# EAGLE design ME433_proto_board_Athulya (EAGLE 5.12)
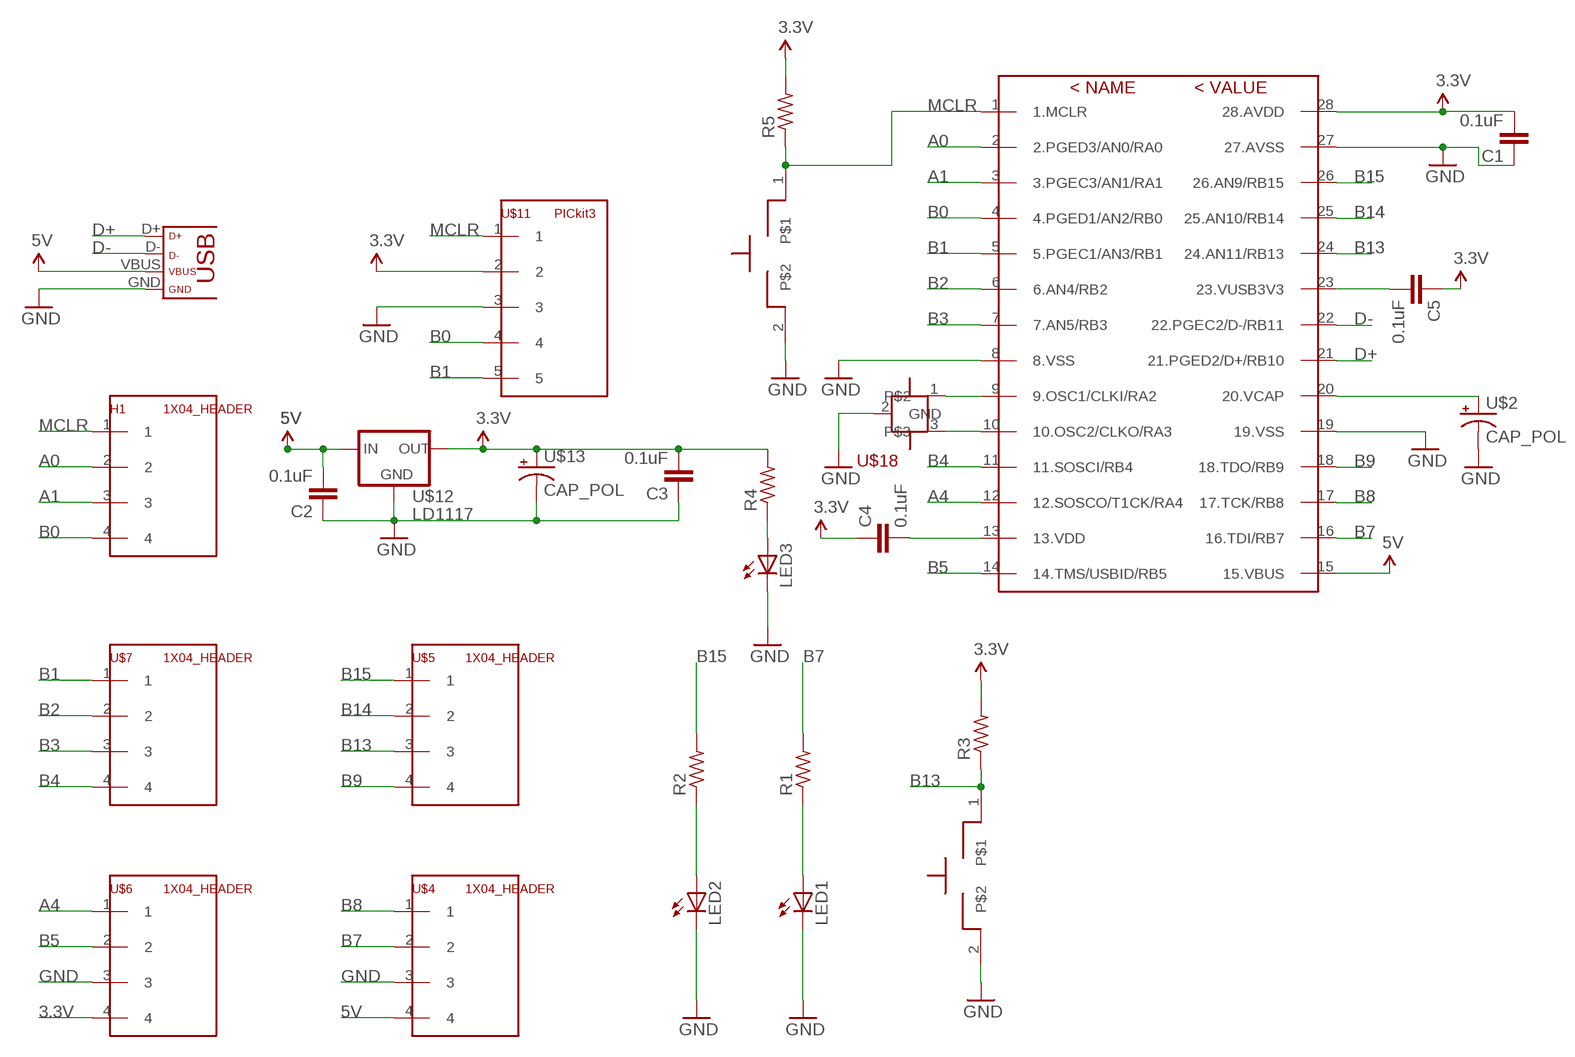
[diagram p0: schematic, sheet 1]

## Parts
C1  0.1uF  C-EU025-025X050  [C025-025X050]
C2  0.1uF  C-EU025-025X050  [C025-025X050]
C3  0.1uF  C-EU025-025X050  [C025-025X050]
C4  0.1uF  C-EU025-025X050  [C025-025X050]
C5  0.1uF  C-EU025-025X050  [C025-025X050]
H1  1X04_HEADER  [1X04]
LED1  LED3MM  [LED3MM]
LED2  LED3MM  [LED3MM]
LED3  LED3MM  [LED3MM]
R1  R-US_0204/7  [0204/7]
R2  R-US_0204/7  [0204/7]
R3  R-US_0204/7  [0204/7]
R4  R-US_0204/7  [0204/7]
R5  R-US_0204/7  [0204/7]
U$1  PIC32  [DIL28-3]
U$2  CAP_POL  [CAP_POL_D]
U$4  1X04_HEADER  [1X04]
U$5  1X04_HEADER  [1X04]
U$6  1X04_HEADER  [1X04]
U$7  1X04_HEADER  [1X04]
U$9  USB  [USB-MINIB]
U$11  PICkit3  1X05_HEADER  [1X05]
U$12  LD1117  [TO220]
U$13  CAP_POL  [CAP_POL_D]
U$16  BUTTON  BUTTOIN  [0204/5]
U$17  BUTTON  BUTTOIN  [0204/5]
U$18  CRYSTAL  [1X03]

## Nets
3.3V: C1.2 C3.2 C4.1 C5.1 R3.2 R4.2 R5.2 U$1.28(28.AVDD) U$6.4 U$11.2 U$12.2(OUT) U$13.1(+)
5V: C2.2 U$1.15(15.VBUS) U$4.4 U$9.VBUS U$12.3(IN)
A0: H1.2 U$1.2(2.PGED3/AN0/RA0)
A1: H1.3 U$1.3(3.PGEC3/AN1/RA1)
A4: U$1.12(12.SOSCO/T1CK/RA4) U$6.1
B0: H1.4 U$1.4(4.PGED1/AN2/RB0) U$11.4
B1: U$1.5(5.PGEC1/AN3/RB1) U$7.1 U$11.5
B2: U$1.6(6.AN4/RB2) U$7.2
B3: U$1.7(7.AN5/RB3) U$7.3
B4: U$1.11(11.SOSCI/RB4) U$7.4
B5: U$1.14(14.TMS/USBID/RB5) U$6.2
B7: R1.2 U$1.16(16.TDI/RB7) U$4.2
B8: U$1.17(17.TCK/RB8) U$4.1
B9: U$1.18(18.TDO/RB9) U$5.4
B13: R3.1 U$1.24(24.AN11/RB13) U$5.3 U$17.1
B14: U$1.25(25.AN10/RB14) U$5.2
B15: R2.2 U$1.26(26.AN9/RB15) U$5.1
D+: U$1.21(21.PGED2/D+/RB10) U$9.D+
D-: U$1.22(22.PGEC2/D-/RB11) U$9.D-
GND: C1.1 C2.1 C3.1 LED1.K(C) LED2.K(C) LED3.K(C) U$1.8(8.VSS) U$1.19(19.VSS) U$1.27(27.AVSS) U$2.2(-) U$4.3 U$6.3 U$9.GND U$11.3 U$12.1(GND) U$13.2(-) U$16.2 U$17.2 U$18.2(GND)
MCLR: H1.1 R5.1 U$1.1(1.MCLR) U$11.1 U$16.1
N$1: U$1.9(9.OSC1/CLKI/RA2) U$18.1
N$2: U$1.20(20.VCAP) U$2.1(+)
N$3: LED1.A R1.1
N$4: LED2.A R2.1
N$5: LED3.A R4.1
N$6: U$1.10(10.OSC2/CLKO/RA3) U$18.3
N$8: C4.2 U$1.13(13.VDD)
N$9: C5.2 U$1.23(23.VUSB3V3)

## Library data of the parts
C1-C5 = ME433:C-EU: CAPACITOR, European symbol
H1 U$4-U$7 = ME433:1X04_HEADER
LED1-LED3 = ME433:LED: LED OSRAM: - CHIPLED LG R971, LG N971, LY N971, LG Q971, LY Q971, LO R971, LY R971 LH N974, LH R974 LS Q976, LO Q976, LY Q976 LO Q996 - Hyper CHIPLED LW Q18S LB Q993, LB Q99A, LB R99A - SideLED LS A670, LO A670, LY A670, LG A670, LP A670 LB A673, LV A673, LT A673, LW A673 LH A674 LY A675 LS A676, LA A676, LO A676, LY A676, LW A676 LS A679, LY A679, LG A679 - Hyper Micro SIDELED® LS Y876, LA Y876, LO Y876, LY Y876 LT Y87S - SmartLED LW L88C, LW L88S LB L89C, LB L89S, LG L890 LS L89K, LO L89K, LY L89K LS L896, LA L896, LO L896, LY L896 - TOPLED LS T670, LO T670, LY T670, LG T670, LP T670 LSG T670, LSP T670, LSY T670, LOP T670, LYG T670 LG T671, LOG T671, LSG T671 LB T673, LV T673, LT T673, LW T673 LH T674 LS T676, LA T676, LO T676, LY T676, LB T676, LH T676, LSB T676, LW T676 LB T67C, LV T67C, LT T67C, LS T67K, LO T67K, LY T67K, LW E67C LS E67B, LA E67B, LO E67B, LY E67B, LB E67C, LV E67C, LT E67C LW T67C LS T679, LY T679, LG T679 LS T770, LO T770, LY T770, LG T770, LP T770 LB T773, LV T773, LT T773, LW T773 LH T774 LS E675, LA E675, LY E675, LS T675 LS T776, LA T776, LO T776, LY T776, LB T776 LHGB T686 LT T68C, LB T68C - Hyper Mini TOPLED® LB M676 - Mini TOPLED Santana® LG M470 LS M47K, LO M47K, LY M47K Source: http://www.osram.convergy.de LUXEON: - LUMILED® LXK2-PW12-R00, LXK2-PW12-S00, LXK2-PW14-U00, LXK2-PW14-V00 LXK2-PM12-R00, LXK2-PM12-S00, LXK2-PM14-U00 LXK2-PE12-Q00, LXK2-PE12-R00, LXK2-PE12-S00, LXK2-PE14-T00, LXK2-PE14-U00 LXK2-PB12-K00, LXK2-PB12-L00, LXK2-PB12-M00, LXK2-PB14-N00, LXK2-PB14-P00, LXK2-PB14-Q00 LXK2-PR12-L00, LXK2-PR12-M00, LXK2-PR14-Q00, LXK2-PR14-R00 LXK2-PD12-Q00, LXK2-PD12-R00, LXK2-PD12-S00 LXK2-PH12-R00, LXK2-PH12-S00 LXK2-PL12-P00, LXK2-PL12-Q00, LXK2-PL12-R00 Source: www.luxeon.com KINGBRIGHT: KA-3528ASYC Source: www.kingbright.com
R1-R5 = ME433:R-US_: RESISTOR, American symbol
U$1 = ME433:PIC32
U$2 U$13 = ME433:CAP_POL
U$9 = ME433:USB
U$11 = ME433:1X05_HEADER
U$12 = ME433:LD1117
U$16 U$17 = ME433:BUTTOIN
U$18 = ME433:CRYSTAL

## Board
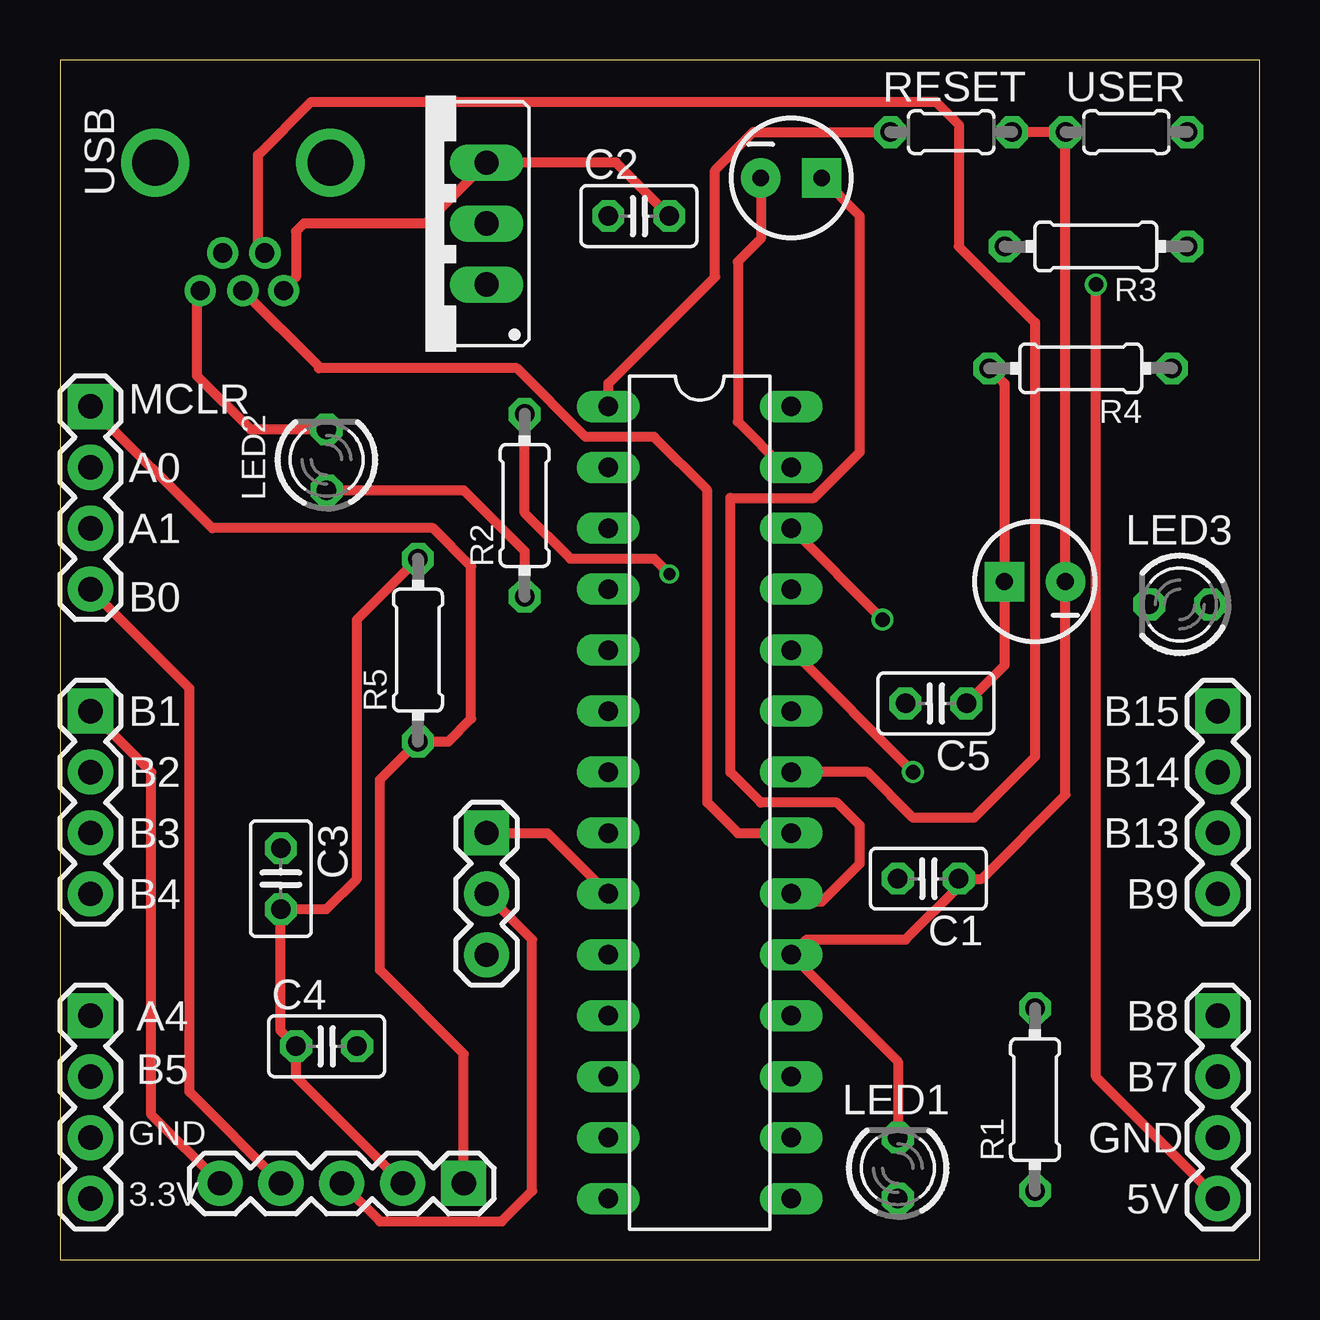
[diagram p1: board, top side]
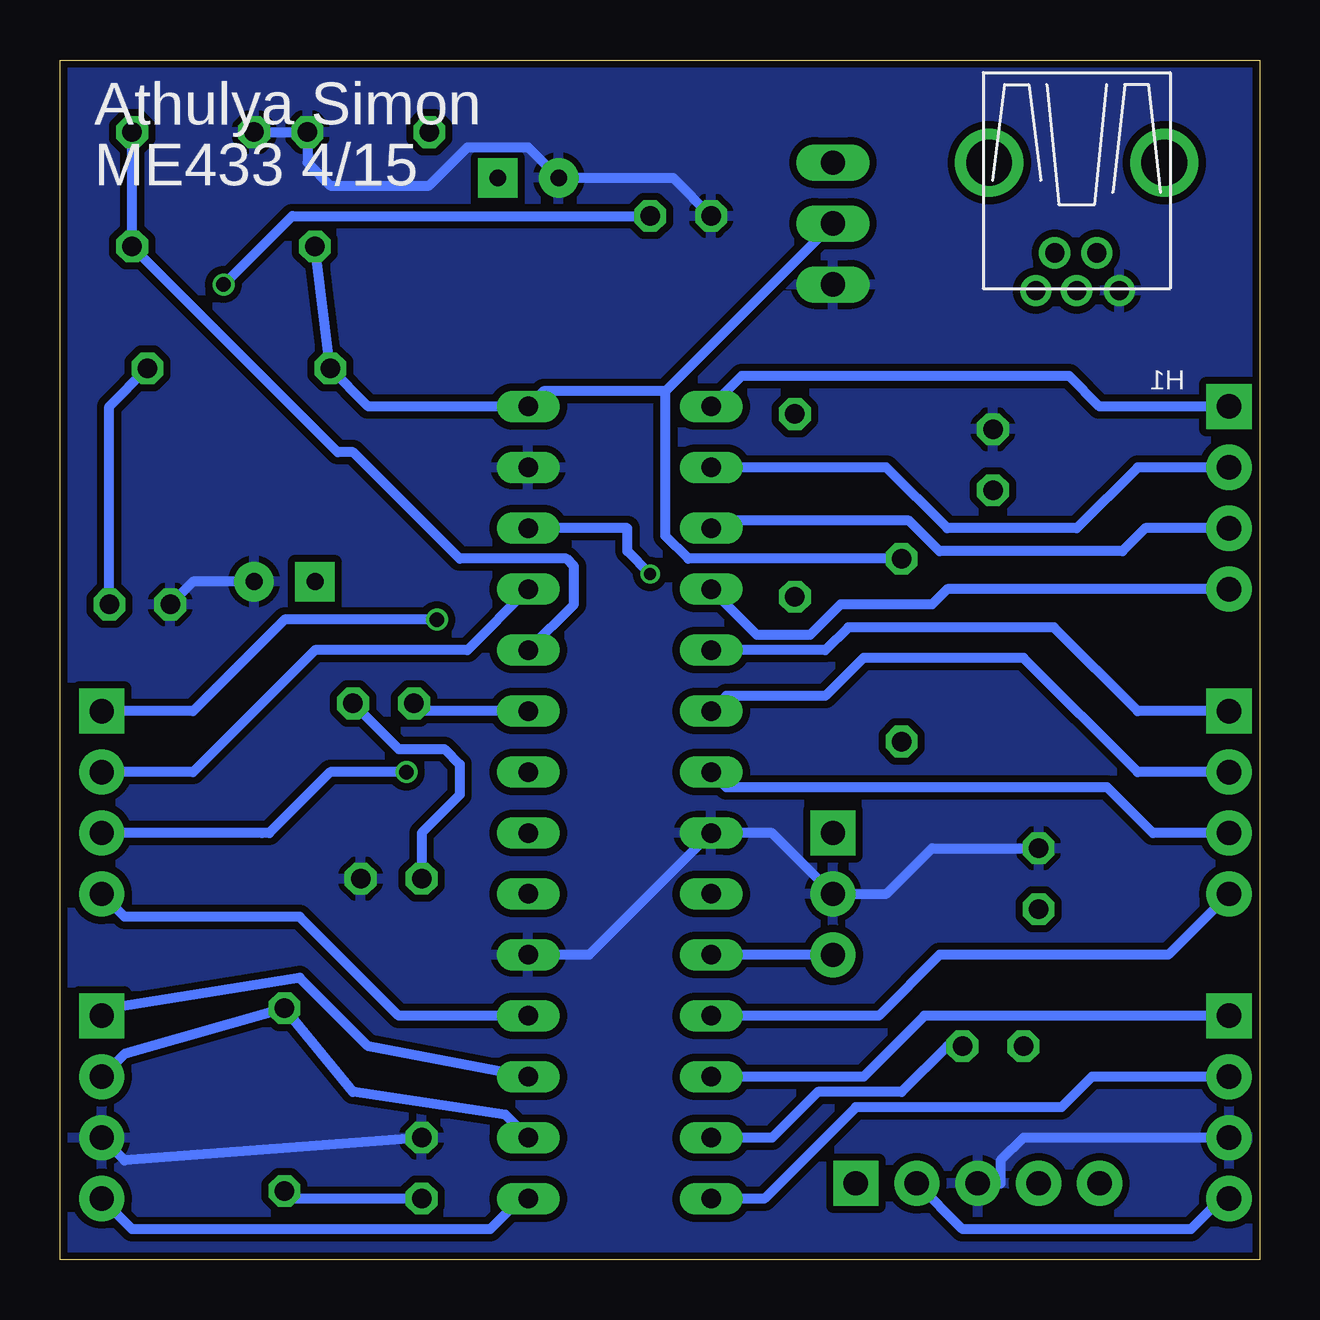
[diagram p2: board, bottom side, seen from below]

Size 50 x 50 mm. Coordinates in mm from the lower left corner, seen from the top.
Outline: 0,0 50,0 50,50 0,50 0,0
Copper layers (1*16): Top 0.035mm / dielectric 1.5mm / Bottom 0.035mm
Design rules "SeeedStudio_2layer_DRU_no_angle_20140221": minimum track width 6mil, minimum drill 12mil, track to track 6mil, track to pad 6mil, pad to pad 6mil, via to via 6mil, smd to smd 0mil, copper to edge 10mil, drill to drill 10mil, minimum pad ring 10mil, minimum via ring 6mil, stop-mask expansion 2mil, vias tented up to drill 100mil, thermal gap 10mil

### Footprints (pad centres in the part's own frame; a part is rotated, then mirrored left to right if it is on the bottom)
C025-025X050 = drill 0.813 octagon: 1 -1.27,0; 2 1.27,0
1X04 = drill 1.016 pad 1.88 square: 1 0,0 | drill 1.016 pad 1.88 round: 2 2.54,0; 3 5.08,0; 4 7.62,0
LED3MM = drill 0.813 octagon: A -1.27,0; K 1.27,0
0204/7 = drill 0.813 octagon: 1 -3.81,0; 2 3.81,0
DIL28-3 = drill 0.813 long: 1 -16.51,-3.81; 2 -13.97,-3.81; 3 -11.43,-3.81; 4 -8.89,-3.81; 5 -6.35,-3.81; 6 -3.81,-3.81; 7 -1.27,-3.81; 8 1.27,-3.81; 9 3.81,-3.81; 10 6.35,-3.81; 11 8.89,-3.81; 12 11.43,-3.81; 13 13.97,-3.81; 14 16.51,-3.81; 15 16.51,3.81; 16 13.97,3.81; 17 11.43,3.81; 18 8.89,3.81; 19 6.35,3.81; 20 3.81,3.81; 21 1.27,3.81; 22 -1.27,3.81; 23 -3.81,3.81; 24 -6.35,3.81; 25 -8.89,3.81; 26 -11.43,3.81; 27 -13.97,3.81; 28 -16.51,3.81
CAP_POL_D = drill 0.7 pad 1.651 square: 1 1.27,0 | drill 0.7 pad 1.651 round: 2 -1.27,0
USB-MINIB = drill 0.8 round: D+ 4.064,0; D- 2.489,0.914; GND 4.064,-1.778; ID 2.489,-0.838; VBUS 4.064,1.702 | drill 1.9 round: P$6 -1.27,-3.65; P$7 -1.27,3.65
1X05 = drill 1.016 pad 1.88 square: 1 0,0 | drill 1.016 pad 1.88 round: 2 2.54,0; 3 5.08,0; 4 7.62,0; 5 10.16,0
TO220 = drill 1.016 long: 1 -2.54,0; 2 0,0; 3 2.54,0
0204/5 = drill 0.813 octagon: 1 -2.54,0; 2 2.54,0
1X03 = drill 1.016 pad 1.88 square: 1 0,0 | drill 1.016 pad 1.88 round: 2 2.54,0; 3 5.08,0

### Placement (x,y rotation side)
C1  36.2,15.88 180 top
C2  24.13,43.5 0 top
C3  9.21,15.88 270 top
C4  11.11,8.89 0 top
C5  36.51,23.18 180 top
H1  1.27,35.56 270 top
LED1  34.92,3.81 90 top
LED2  11.11,33.34 90 top
LED3  46.67,27.3 180 top
R1  40.64,6.67 90 top
R2  19.37,31.43 90 top
R3  43.18,42.23 180 top
R4  42.55,37.15 180 top
R5  14.92,25.4 90 top
U$1  26.67,19.05 270 top
U$2  30.48,45.09 0 top
U$4  48.26,10.16 270 top
U$5  48.26,22.86 270 top
U$6  1.27,10.16 270 top
U$7  1.27,22.86 270 top
U$9  7.62,44.45 270 top
U$11  16.83,3.17 180 top
U$12  17.78,43.18 90 top
U$13  40.64,28.26 180 top
U$16  37.15,46.99 0 top
U$17  44.45,46.99 180 top
U$18  17.78,17.78 270 top

### Tracks (layer width: path | path; a pad name or v marks a point on that pad's centre or on a via)
3.3V
  Top 0.406: R4.2 39.37,36.51 U$13.1 39.37,24.77 C5.1 | U$11.2 9.84,7.62 C4.1 9.21,9.53 C3.2 11.11,14.61 12.38,15.88 12.38,26.67 R5.2
  Bottom 0.254: R3.2 39.37,41.91
  Bottom 0.406: R3.2 R4.2 37.15,35.56 U$1.28 29.84,36.2 24.77,36.2 | C5.1 35.88,21.27 33.97,21.27 33.34,20.64 33.34,19.37 34.92,17.78 C1.2 | U$6.4 1.59,2.54 2.86,1.27 12.38,1.27 U$11.2 | R5.2 23.81,29.21 24.77,30.16 24.77,36.2 | 24.77,36.2 U$12.2
5V  (via drill 0.61)
  Top 0.406: v43.18,40.64 43.18,7.62 U$4.4 | C2.2 23.18,45.72 U$12.3 15.24,43.18 10.16,43.18 9.84,42.86 9.84,40.96 9.32,40.44 U$9.VBUS
  Bottom 0.406: v43.18,40.64 40.32,43.5 C2.2 | U$1.15 30.8,2.54 32.07,1.27 46.99,1.27 U$4.4
A0
  Bottom 0.406: H1.2 5.08,33.02 7.62,30.48 13.02,30.48 15.56,33.02 U$1.2
A1
  Bottom 0.406: H1.3 4.76,30.48 5.71,29.53 13.34,29.53 14.61,30.8 22.54,30.8 U$1.3
A4
  Bottom 0.406: U$6.1 13.97,10.16 16.51,7.62 U$1.12
B0
  Top 0.406: U$11.4 5.4,6.99 5.4,23.81 H1.4
  Bottom 0.406: H1.4 13.02,27.94 13.65,27.3 17.46,27.3 18.73,26.04 20.95,26.04 U$1.4
B1
  Top 0.406: U$11.5 3.81,6.03 3.81,20.32 U$7.1
  Bottom 0.406: U$7.1 5.08,22.86 8.57,26.35 17.14,26.35 18.1,25.4 U$1.5
B2
  Bottom 0.406: U$7.2 5.08,20.32 9.84,25.08 16.51,25.08 18.1,23.5 22.23,23.5 U$1.6
B3
  Bottom 0.406: U$7.3 4.45,17.78 6.35,19.68 22.23,19.68 U$1.7
B4
  Bottom 0.406: U$1.11 15.88,10.16 13.34,12.7 3.81,12.7 U$7.4
B5
  Bottom 0.406: U$6.2 6.99,7.62 8.26,6.35 16.83,6.35 20.64,2.54 U$1.14
B7
  Bottom 0.406: U$4.2 47.31,8.57 R1.2 37.78,6.99 31.43,6.03 U$1.16
B8
  Bottom 0.406: U$1.17 37.15,8.89 40.01,11.75 47.94,10.48 U$4.1
B9
  Bottom 0.406: U$1.18 35.88,10.16 40.01,14.29 47.31,14.29 U$5.4
B13  (via drill 0.61)
  Top 0.406: U$1.24 v35.56,20.32
  Bottom 0.406: U$1.24 28.57,27.3 28.57,28.89 28.89,29.21 33.34,29.21 37.78,33.66 38.42,33.66 R3.1 U$17.1 | v35.56,20.32 38.73,20.32 41.27,17.78 41.59,17.78 | 41.59,17.78 U$5.3 | 41.59,17.78 48.58,17.78
B14
  Bottom 0.406: U$1.25 33.02,25.4 39.37,25.4 44.45,20.32 U$5.2
B15  (via drill 0.5, 0.61)
  Top 0.406: U$1.26 v34.29,26.67 | R2.2 19.37,31.11 21.27,29.21 24.77,29.21 v25.4,28.57
  Bottom 0.406: v34.29,26.67 40.64,26.67 44.45,22.86 U$5.1 | U$1.26 26.35,30.48 26.35,29.53 v25.4,28.57
D+
  Top 0.406: U$1.21 28.26,17.78 26.99,19.05 26.99,32.07 24.77,34.29 21.91,34.29 19.05,37.15 10.79,37.15 10.79,37.21 U$9.D+
D-
  Top 0.406: U$1.22 33.66,20.32 35.56,18.41 38.1,18.41 40.64,20.95 40.64,39.05 37.47,42.23 37.47,47.31 36.51,48.26 10.48,48.26 8.26,46.04 8.26,42.24 U$9.D-
GND
  Top 0.406: U$16.2 U$17.2 U$13.2 41.91,19.37 38.42,15.88 C1.1 37.47,15.56 35.24,13.34 31.11,13.34 U$1.19 34.92,8.26 LED1.K | U$18.2 19.68,13.34 19.68,2.86 18.41,1.59 13.34,1.59 U$11.3 | LED2.K 7.94,34.61 5.71,36.83 5.71,40.26 U$9.GND | U$1.27 30.16,33.02 28.26,34.92 28.26,41.59 29.21,42.55 U$2.2
  Bottom 0.406: U$17.2 U$16.2 39.69,45.72 38.73,44.77 34.61,44.77 33.02,46.35 30.48,46.35 U$2.2 24.45,45.09 C2.1 | U$13.2 44.45,28.26 LED3.K | LED1.K 47.31,4.13 U$4.3 | U$1.19 27.94,12.7 U$1.8 20.32,17.78 U$18.2 15.56,15.24 13.65,17.14 C3.1 | U$6.3 9.84,5.08 10.79,4.13 10.79,3.17 U$11.3
  pour Bottom (isolate 0.305): 0.32,49.53 0.32,0 50.16,0 50.16,49.85 0.32,49.85
MCLR
  Top 0.406: 0.95,35.88 H1.1 6.35,30.48 15.56,30.48 17.14,28.89 17.14,22.54 16.19,21.59 R5.1 13.34,20 13.34,12.06 16.83,8.57 U$11.1 | U$1.1 22.86,36.51 27.3,40.96 27.3,45.4 28.89,46.99 U$16.1
  Bottom 0.406: H1.1 6.67,35.56 7.94,36.83 21.59,36.83 U$1.1
N$1
  Top 0.406: U$18.1 20.32,17.78 U$1.9
N$2
  Top 0.406: U$2.1 33.34,43.5 33.34,33.66 31.43,31.75 27.94,31.75 27.94,20.32 29.21,19.05 32.38,19.05 33.34,18.1 33.34,16.51 31.75,14.92 30.8,14.92 U$1.20
N$3
  Bottom 0.406: LED1.A 40.32,2.54 R1.1
N$4
  Top 0.406: R2.1 19.37,29.53 16.83,32.07 LED2.A
N$5
  Bottom 0.406: LED3.A 47.94,35.56 R4.1
N$6
  Bottom 0.406: U$18.3 U$1.10
N$8
  Bottom 0.406: U$1.13 20.32,5.08 18.41,6.99 14.92,6.99 13.02,8.89 C4.2
N$9
  Bottom 0.406: U$1.23 34.92,22.86 C5.2

### Text on the board
tPlace: RESET | USER | MCLR | A0 | A1 | B0 | B1 | B15 | B2 | B14 | B3 | B13 | B4 | B9 | A4 | B8 | B5 | B7 | GND | GND | 3.3V | 5V
bPlace: Athulya Simon | ME433 4/15